# EAGLE schematic adcbuttons (EAGLE 7.1.0)
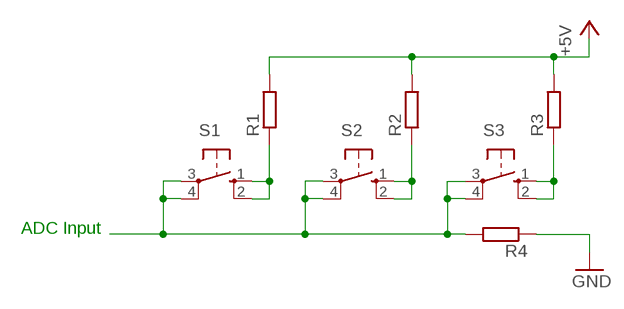
[diagram p0: schematic, sheet 1]

## Parts
R1  R-EU_0309/10  [0309/10]
R2  R-EU_0309/10  [0309/10]
R3  R-EU_0309/10  [0309/10]
R4  R-EU_0309/10  [0309/10]
S1  10-XX  [B3F-10XX]
S2  10-XX  [B3F-10XX]
S3  10-XX  [B3F-10XX]

## Nets
+5V: R1.2 R2.2 R3.2
GND: R4.1
N$1: R4.2 S1.3(P) S1.4(P1) S2.3(P) S2.4(P1) S3.3(P) S3.4(P1)
N$4: R1.1 S1.1(S) S1.2(S1)
N$5: R2.1 S2.1(S) S2.2(S1)
N$6: R3.1 S3.1(S) S3.2(S1)

## Notes on the sheet
- ADC Input

## Library data of the parts
R1-R4 = rcl:R-EU_: RESISTOR, European symbol
S1-S3 = switch-omron:10-XX: OMRON SWITCH; MPN: B3F-1000; OC_FARNELL: 176432; OC_NEWARK: 36M3542